# Altium schematic sheet CAM_IF.SchDoc
size C; SheetNumber: 2; SheetTotal: 2
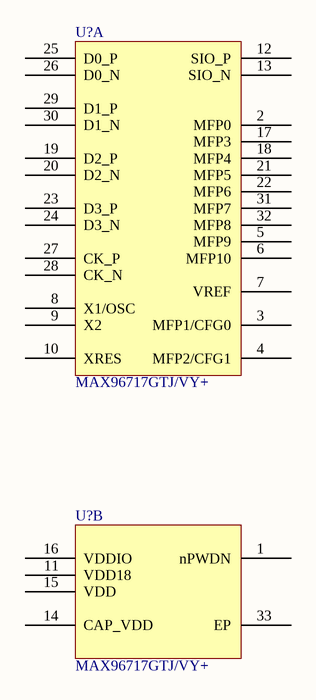
[diagram p0: CAM_IF.SchDoc]

## Parts
(Parts that share a designator on the sheet are numbered #1, #2 ... from top to bottom, then left to right.)
U?#1  MAX96717GTJ/VY+  [PQFN50P500X500X80_HS-33N]  (part A of 2)
U?#2  MAX96717GTJ/VY+  [PQFN50P500X500X80_HS-33N]  (part B of 2)

## Nets

Not connected (* = marked no-connect by the designer): U?#1 2(MFP0) 3(MFP1/CFG0) 4(MFP2/CFG1) 5(MFP9) 6(MFP10) 7(VREF) 8(X1/OSC) 9(X2) 10(XRES) 12(SIO_P) 13(SIO_N) 17(MFP3) 18(MFP4) 19(D2_P) 20(D2_N) 21(MFP5) 22(MFP6) 23(D3_P) 24(D3_N) 25(D0_P) 26(D0_N) 27(CK_P) 28(CK_N) 29(D1_P) 30(D1_N) 31(MFP7) 32(MFP8); U?#2 1(nPWDN) 11(VDD18) 14(CAP_VDD) 15(VDD) 16(VDDIO) 33(EP)

## Library data of the parts
U?#1 U?#2 = CMP-015-00013-1: GMSL2 Compact Serializer